# Altium schematic sheet for description.SchDoc: Имя
size 209 x 297 mm; ApprovedBy: Утвердил; CheckedBy: Проверил; Author: Разработал; Organization: НГУ; DocumentNumber: Децимальный номер Э3; SheetNumber: Лист; SheetTotal: Листов; PageSetup: Record=PageOptions|CenterHorizontal=True|CenterVertical=True|PrintScale=1.00|XCorrection=1.00|YCorrection=1.00|PrintKind=1|BorderSize=5000000|LeftOffset=0|BottomOffset=0|Orientation=2|PaperLength=1000|PaperWidth=1000|Scale=100|PaperSource=15|PrintQuality=1200|MediaType=1|DitherType=10|PaperKind=A3|PrintScaleMode=1; Weight: -; ScaleFactor: -; NormInspection: Норм.Контр.
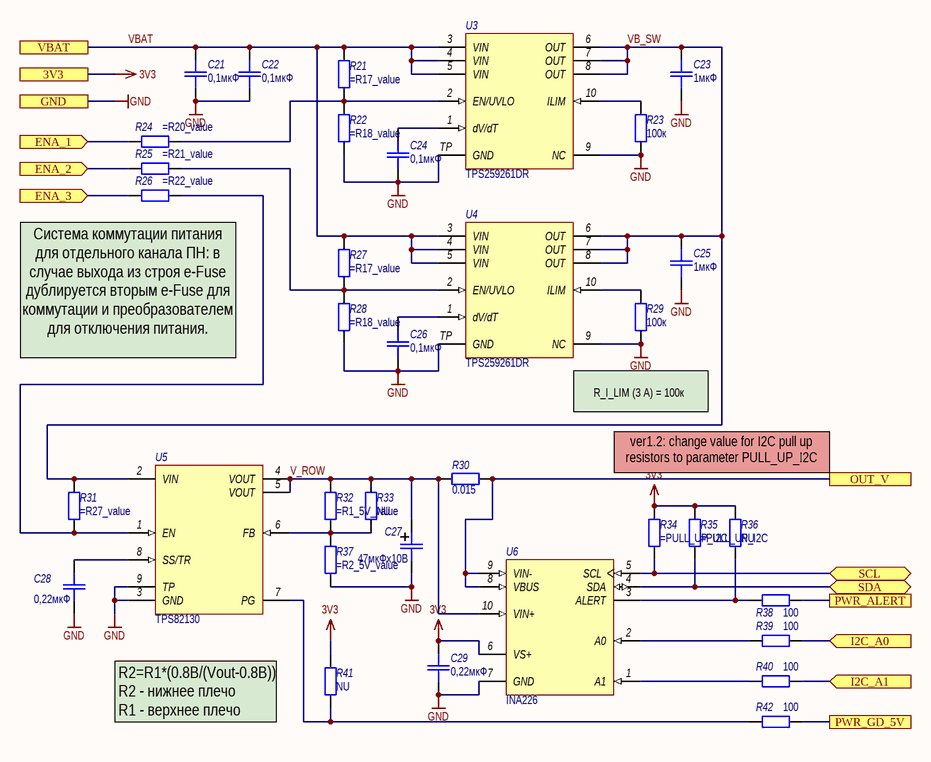
[diagram p0: for description.SchDoc]

## Parts
C21  0,1мкФ  [CR-0603]
C22  0,1мкФ  [CR-0603]
C23  1мкФ  [CR-0603]
C24  0,1мкФ  [CR-0603]
C25  1мкФ  [CR-0603]
C26  0,1мкФ  [CR-0603]
C27  47мкФх10В  [C_SMD_SIZE_B]
C28  0,22мкФ  [CR-0603]
C29  0,22мкФ  [CR-0603]
R21  R17_value  [CR-0603]  (value not drawn)
R22  R18_value  [CR-0603]  (value not drawn)
R23  100к  [CR-0603]
R24  (no value)  [CR-0603]
R25  (no value)  [CR-0603]
R26  (no value)  [CR-0603]
R27  R17_value  [CR-0603]  (value not drawn)
R28  R18_value  [CR-0603]  (value not drawn)
R29  100к  [CR-0603]
R30  value 0.015  [CR-1206]  (hidden comment: 0,01)
R31  (no value)  [CR-0603]
R32  (no value)  [CR-0603]
R33  NU  [CR-0603]
R34  (no value)  [CR-0603]
R35  (no value)  [CR-0603]
R36  NU  [CR-0603]
R37  (no value)  [CR-0603]
R38  100  [CR-0603]
R39  100  [CR-0603]
R40  100  [CR-0603]
R41  NU  [CR-0603]
R42  100  [CR-0603]
U3  Наименование: TPS259261DR  [VSON-10]  (hidden comment: TPS259261ВК)
U4  Наименование: TPS259261DR  [VSON-10]  (hidden comment: TPS259261ВК)
U5  TPS82130  [uSiL-8]
U6  INA226  [VSSOP-8]

## Ports
3V3, ENA_1 (in), ENA_2 (in), ENA_3 (in), GND, I2C_A0 (in), I2C_A1 (in), OUT_V, PWR_ALERT, PWR_GD_5V, SCL (bidir), SDA (bidir), VBAT

## Nets
3V3: C29.2 R34.2 R35.2 R36.2 R41.2 U6.6(VS+) ; port 3V3
GND: C21.1 C22.1 C23.1 C24.1 C25.1 C26.1 C27.2 C28.1 C29.1 R22.2 R23.1 R28.2 R29.1 R37.1 U3.9(NC) U3.TP(GND) U4.9(NC) U4.TP(GND) U5.3(GND) U5.9(TP) U6.7(GND) ; port GND
ENA_1: R24.2 ; port ENA_1
ENA_2: R25.2 ; port ENA_2
ENA_3: R26.2 ; port ENA_3
I2C_A0: R39.1 ; port I2C_A0
I2C_A1: R40.1 ; port I2C_A1
OUT_V: R30.1 U6.8(VBUS) U6.9(VIN-) ; port OUT_V
PWR_ALERT: R38.1 ; port PWR_ALERT
PWR_GD_5V: R42.1 ; port PWR_GD_5V
SCL: R34.1 U6.5(SCL) ; port SCL
SDA: R35.1 U6.4(SDA) ; port SDA
V_ROW: C27.1 R30.2 R32.2 R33.2 U5.4(VOUT) U5.5(VOUT) U6.10(VIN+)
VB_SW: C23.2 C25.2 R31.2 U3.6(OUT) U3.7(OUT) U3.8(OUT) U4.6(OUT) U4.7(OUT) U4.8(OUT) U5.2(VIN)
VBAT: C21.2 C22.2 R21.1 R27.1 U3.3(VIN) U3.4(VIN) U3.5(VIN) U4.3(VIN) U4.4(VIN) U4.5(VIN) ; port VBAT
NetC24_2: C24.2 U3.1(dV/dT)
NetC26_2: C26.2 U4.1(dV/dT)
NetC28_2: C28.2 U5.8(SS/TR)
NetR21_2: R21.2 R22.1 R24.1 U3.2(EN/UVLO)
NetR23_2: R23.2 U3.10(ILIM)
NetR25_1: R25.1 R27.2 R28.1 U4.2(EN/UVLO)
NetR26_1: R26.1 R31.1 U5.1(EN)
NetR29_2: R29.2 U4.10(ILIM)
NetR32_1: R32.1 R33.1 R37.2 U5.6(FB)
NetR36_1: R36.1 R38.2 U6.3(ALERT)
NetR39_2: R39.2 U6.2(A0)
NetR40_2: R40.2 U6.1(A1)
NetR41_1: R41.1 R42.2 U5.7(PG)

## Notes on the sheet
- (near R26) Система коммутации питания для отдельного канала ПН: в случае выхода из строя e-Fuse дублируется вторым e-Fuse для коммутации и преобразователем для отключения питания.
- R_I_LIM (3 А) = 100к
- ver1.2: change value for I2C pull up resistors to parameter PULL_UP_I2C
- R2=R1*(0.8В/(Vout-0.8B))
  R2 - нижнее плечо
  R1 - верхнее плечо
- Подп. и дата
- Инв. № дубл.
- Взам. инв. №
- Инв. № подл.
- Изм.
- Лист
- № докум.
- Подп.
- Дата
- Форма 2а ГОСТ 2.104-2006
- Копировал
- Формат А4

## Library data of the parts
C21-C26 C28 C29 = C_smd: Конденсатор для поверхностного монтажа; Назначение: Чип-конденсатор; Потребление, Вт: 0; Наименование: SMD-0603
  C21 C22 C24 C26: Value: 0,1мкФ
  C23 C25: Value: 1мкФ
  C28 C29: Value: 0,22мкФ
C27 = C_pol_smd: Поляризованный конеднсатор для поверхностного монтажа; Назначение: Поляризованный чип-конденсатор; Наименование: Конденсатор танталовый SMD; Потребление, Вт: 0; Value: 47мкФх10В
R21-R29 R38-R40 R42 = R_smd: Резистор для поверхностного монтажа; Наименование: SMD-0603 20%; Назначение: Чип-резистор; Потребление, Вт: 0,001
  R21 R27: Value: =R17_value
  R22 R28: Value: =R18_value
  R23 R29: Value: 100к
  R24: Value: =R20_value
  R25: Value: =R21_value
  R26: Value: =R22_value
  R38-R40 R42: Value: 100
R30 = R_smd: Резистор для поверхностного монтажа; Назначение: Чип-резистор токоизмерительный; Наименование: PE1206DRM470R015L; Потребление, Вт: 0,001
R31 R34-R36 R41 = R_smd: Резистор для поверхностного монтажа; Назначение: Чип-резистор; Наименование: SMD-0603 20%; Потребление, Вт: 0,001
  R31: Value: =R27_value
  R34 R35: Value: =PULL_UP_I2C
  R36 R41: Value: NU
R32 R33 R37 = R_smd: Резистор для поверхностного монтажа; Назначение: Чип-резистор; Наименование: SMD-0603 1%; Потребление, Вт: 0,001
  R32: Value: =R1_5V_value
  R33: Value: NU
  R37: Value: =R2_5V_value
U3 U4 = TPS259261: Simple 5-V/12-V eFuse Protection Switches; Потребление, Вт: 0,001; Назначение: Simple 5-V/12-V eFuse Protection Switches; ComponentLink1Description: Datasheet; ComponentLink1URL: http://www.ti.com/lit/ds/symlink/tps25925.pdf
U5 = TPS82130: 17-V Input 3-A Step-Down Converter MicroSiP™ Module with Integrated Inductor; Потребление, Вт: 1,0; ComponentLink1Description: Data sheet; ComponentLink1URL: http://www.ti.com/lit/ds/symlink/tps82130.pdf; Назначение: 17-V Input 3-A Step-Down Converter MicroSiP™ Module with Integrated Inductor; Наименование: TPS82130
U6 = INA226: High- or Low-Side Measurement, Bidirectional Current and Power Monitor With I2C Interface; Назначение: High-Side or Low-Side Measurement,; Потребление, Вт: 0,001; ComponentLink1Description: Data sheet; ComponentLink1URL: http://www.ti.com/lit/ds/symlink/ina226.pdf; Наименование: INA226